# Altium project LightLink_V4.PrjPcb (part 2 of 2)

## Sheet STM32H753_PINOUT.SchDoc
size D; SheetNumber: 3; SheetTotal: 5
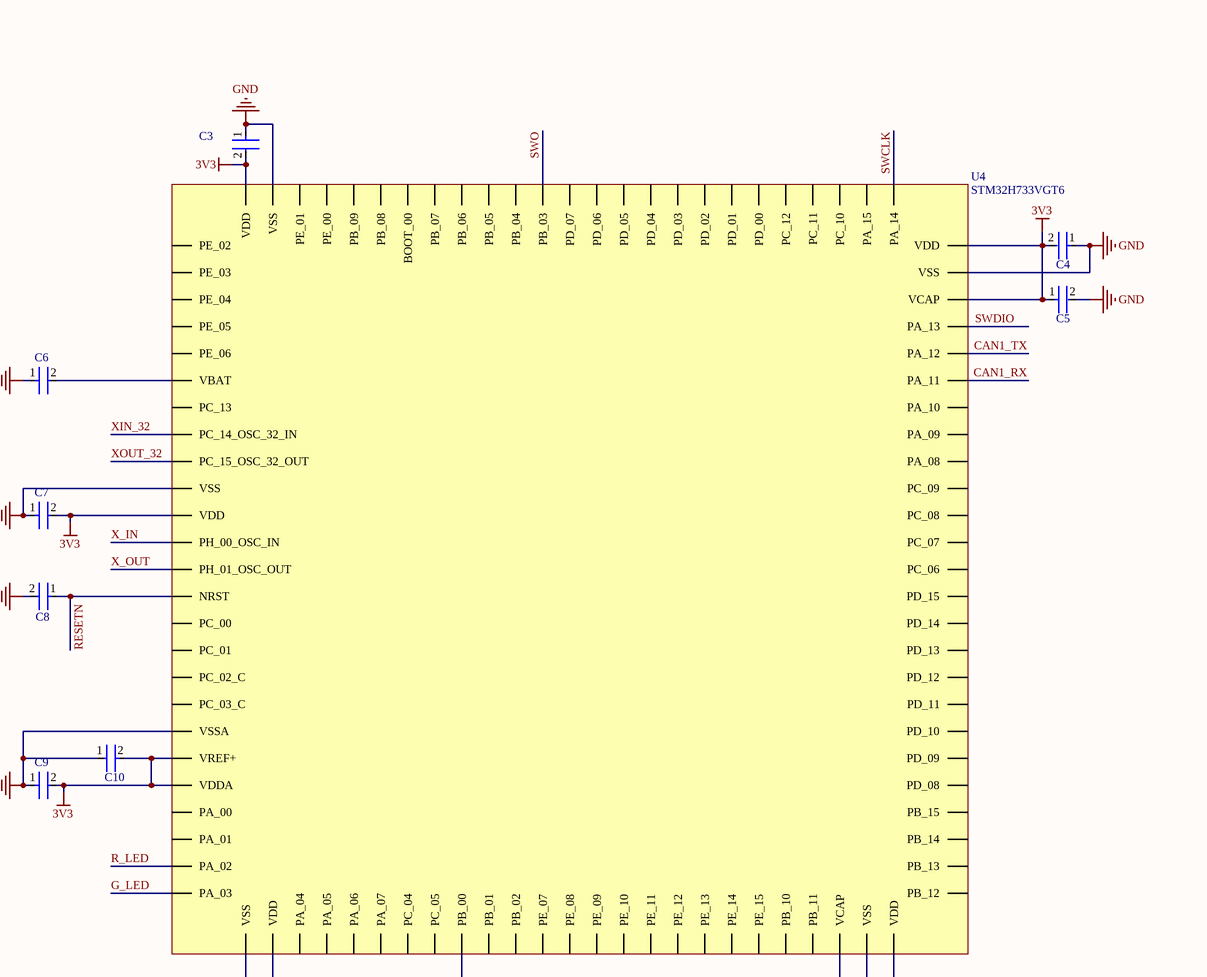
[diagram p5: STM32H753_PINOUT.SchDoc, top middle]
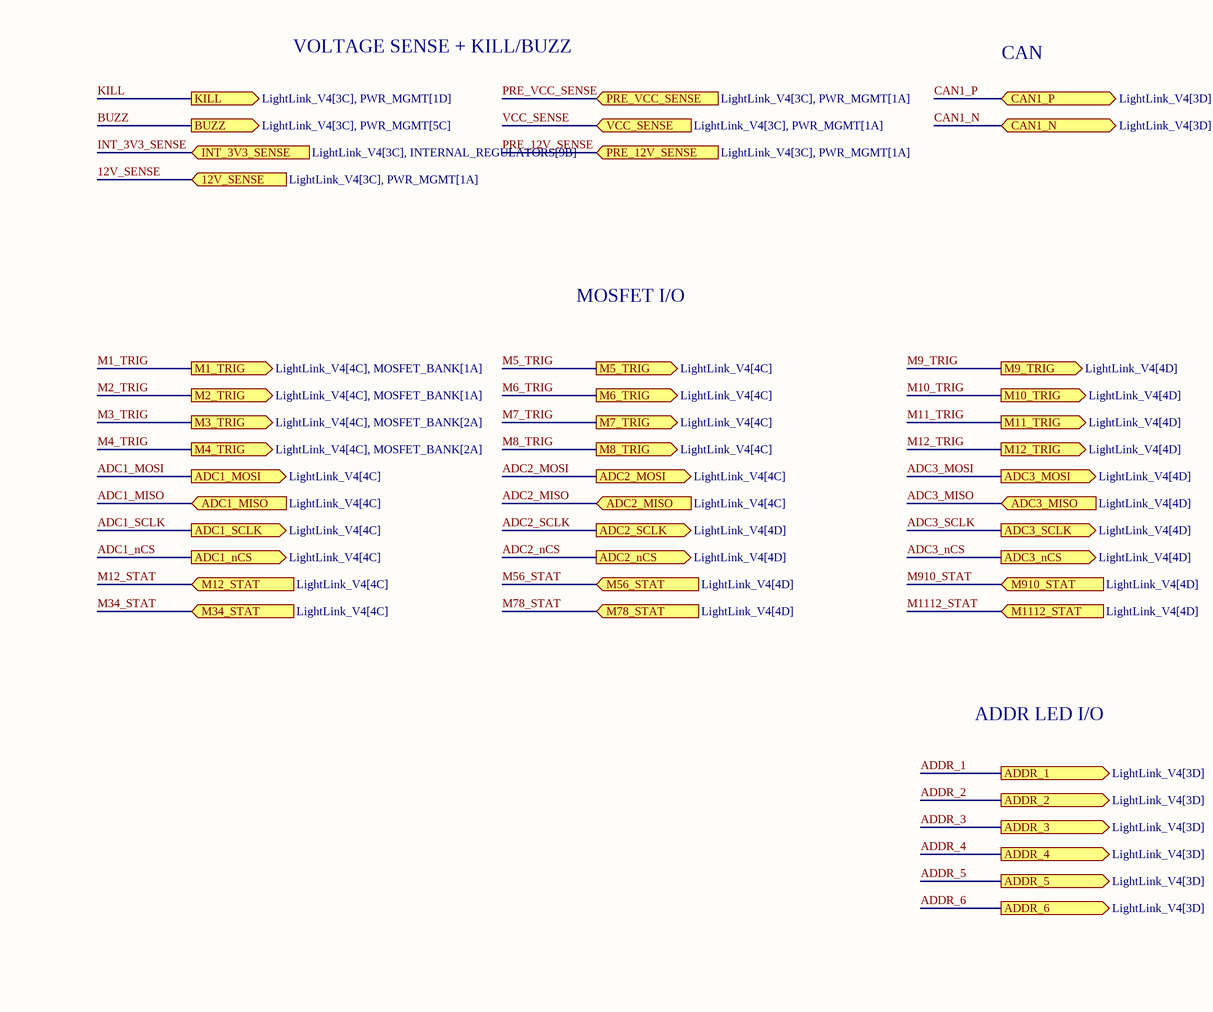
[diagram p6: STM32H753_PINOUT.SchDoc, top right]
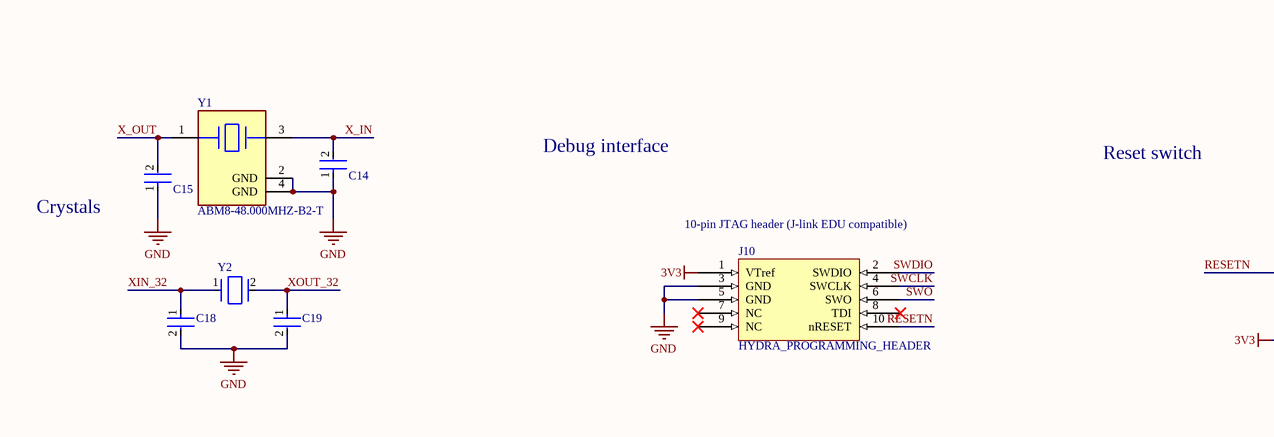
[diagram p7: STM32H753_PINOUT.SchDoc, bottom left]
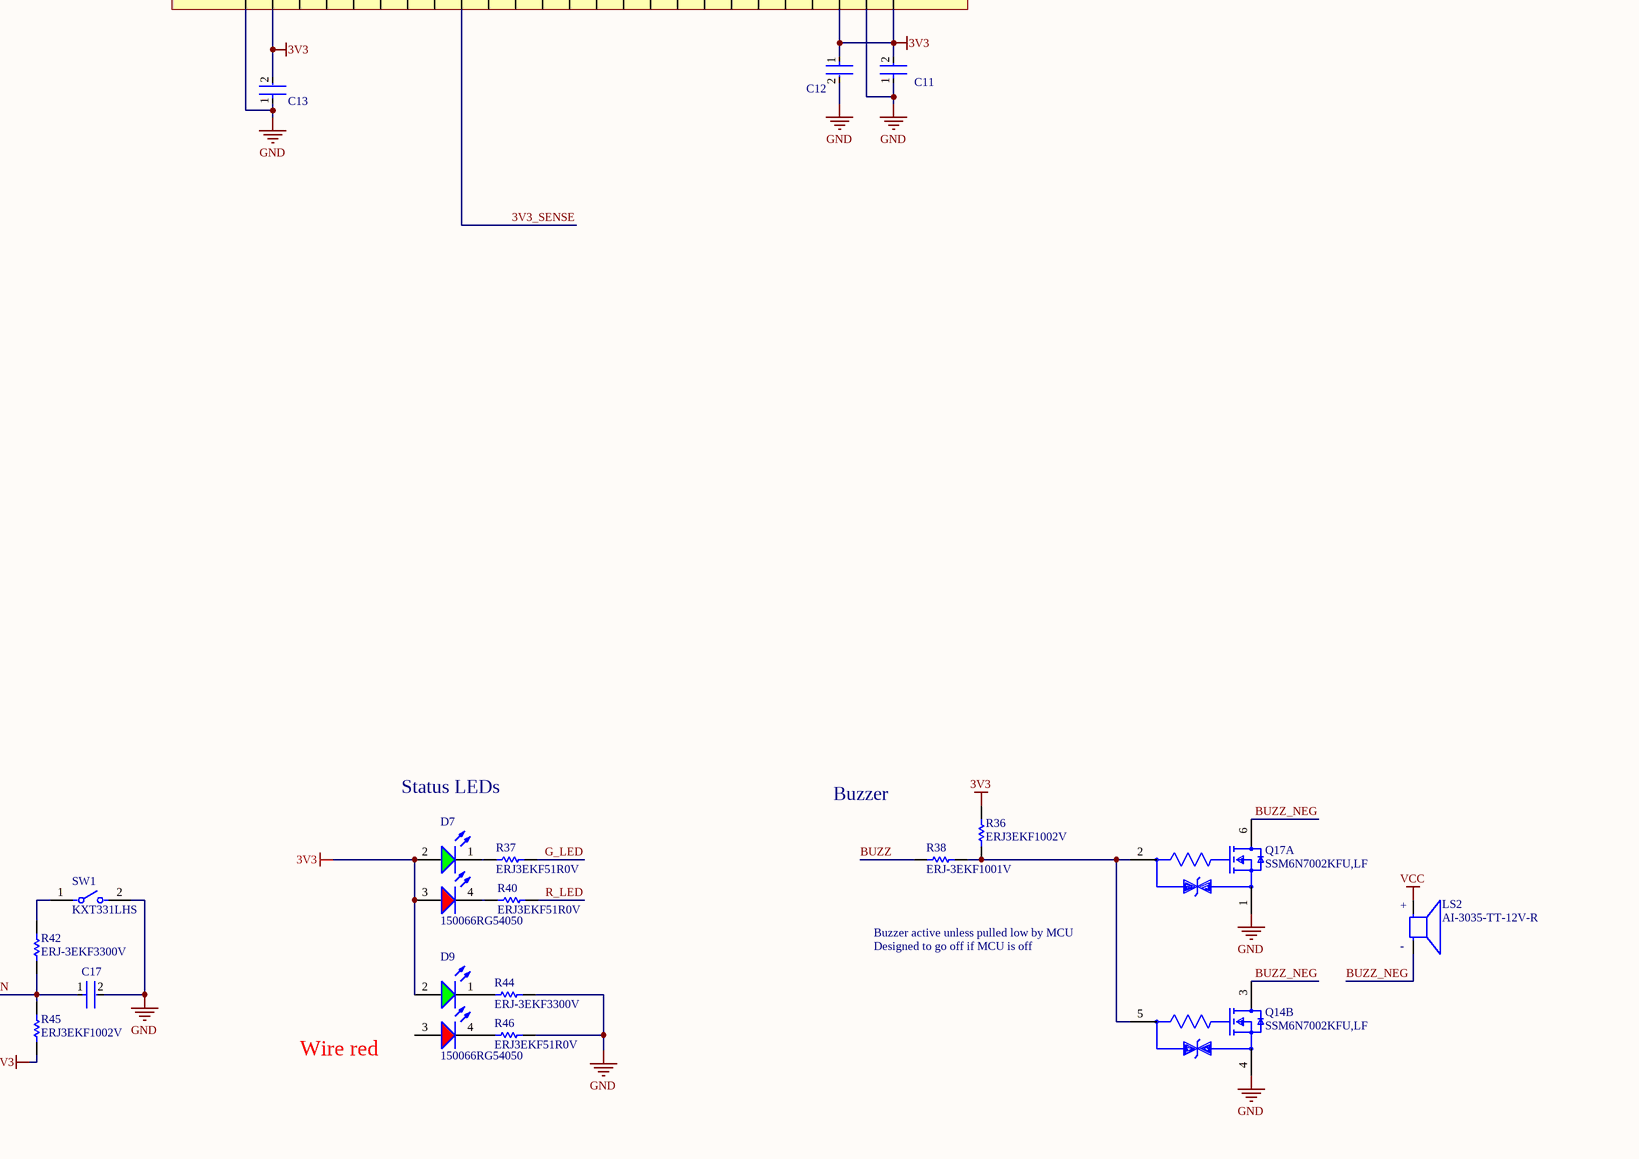
[diagram p8: STM32H753_PINOUT.SchDoc, bottom middle]
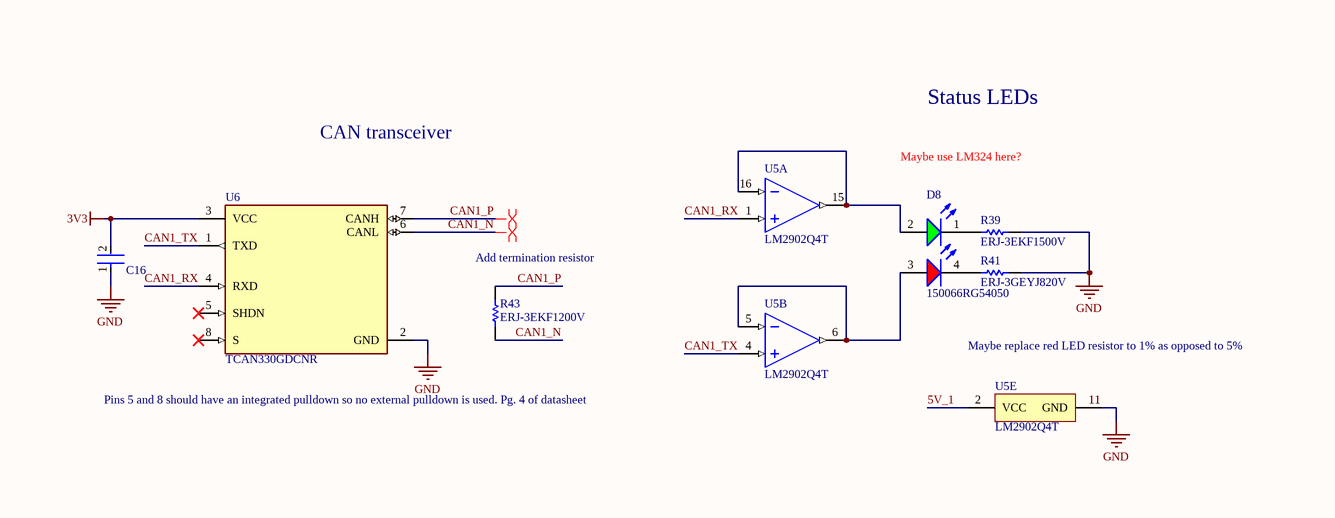
[diagram p9: STM32H753_PINOUT.SchDoc, bottom right]

### Parts
C3  C0402C104K8PACTU  [FP-C0402-BB-MFG]  (value not drawn)
C4  C0402C104K8PACTU  [FP-C0402-BB-MFG]  (value not drawn)
C5  C1005X7S1A225K050BC  [FP-C1005-050-0_15-0_1-MFG]  (value not drawn)
C6  C0402C104K8PACTU  [FP-C0402-BB-MFG]  (value not drawn)
C7  C0402C104K8PACTU  [FP-C0402-BB-MFG]  (value not drawn)
C8  C0402C104K8PACTU  [FP-C0402-BB-MFG]  (value not drawn)
C9  C0402C104K8PACTU  [FP-C0402-BB-MFG]  (value not drawn)
C10  GRM155R71C104KA88D  [FP-GRM15-MFG]  (value not drawn)
C11  C0402C104K8PACTU  [FP-C0402-BB-MFG]  (value not drawn)
C12  C1005X7S1A225K050BC  [FP-C1005-050-0_15-0_1-MFG]  (value not drawn)
C13  C0402C104K8PACTU  [FP-C0402-BB-MFG]  (value not drawn)
C14  08051A6R8CAT2A  [FP-0805-L_2_01_0_2-W_1_25-MFG]  (value not drawn)
C15  08051A6R8CAT2A  [FP-0805-L_2_01_0_2-W_1_25-MFG]  (value not drawn)
C16  C0402C104K8PACTU  [FP-C0402-BB-MFG]  (value not drawn)
C17  C0402C104K8PACTU  [FP-C0402-BB-MFG]  (value not drawn)
C18  C0805C180J5GACTU  [FP-C0805C-DN-MFG]  (value not drawn)
C19  C0805C180J5GACTU  [FP-C0805C-DN-MFG]  (value not drawn)
D7  150066RG54050  [WL-SBCD_0606]
D8  150066RG54050  [WL-SBCD_0606]
D9  150066RG54050  [WL-SBCD_0606]
J10  HYDRA_PROGRAMMING_HEADER  [3220-10-0300-00-Footprint-1]
LS2  AI-3035-TT-12V-R  [AI-3035-TT-12V-R-Footprint-1]
Q14  SSM6N7002KFU,LF  [FP-SSOP6-P-0_65A-MFG]  (part B of 2)
Q17  SSM6N7002KFU,LF  [FP-SSOP6-P-0_65A-MFG]  (part A of 2)
R36  ERJ3EKF1002V  [RESC1609X55X30LL15T15]
R37  ERJ3EKF51R0V  [RESC1608X55X30NL15T15]
R38  ERJ-3EKF1001V  [RESC1608X55X30LL15T15]
R39  ERJ-3EKF1500V  [RESC1608X55X30NL15T15]
R40  ERJ3EKF51R0V  [RESC1608X55X30NL15T15]
R41  ERJ-3GEYJ820V  [RESC1608X55X30NL15T15]
R42  ERJ-3EKF3300V  [RESC1608X55X30LL15T15]
R43  ERJ-3EKF1200V  [RESC1609X55X30ML15T15]
R44  ERJ-3EKF3300V  [RESC1608X55X30LL15T15]
R45  ERJ3EKF1002V  [RESC1609X55X30LL15T15]
R46  ERJ3EKF51R0V  [RESC1608X55X30NL15T15]
SW1  KXT331LHS  [FP-KXT331LHS-MFG]
U4  STM32H733VGT6  [STM32H733VGT6-Footprint-1]
U5  LM2902Q4T  [LM2902Q4T-Footprint-1]  (parts A,B,E of 5)
U6  TCAN330GDCNR  [FP-DCN0008A-MFG]
Y1  ABM8-48.000MHZ-B2-T  [FP-ABM8-MFG]
Y2  ECS-.327-12.5-1210-TR  [FP-ECX-1210-MFG]  (value not drawn)

### Ports
12V_SENSE (in, see LightLink_V4[3C], PWR_MGMT[1A]), ADC1_MISO (in, see LightLink_V4[4C]), ADC1_MOSI (out, see LightLink_V4[4C]), ADC1_nCS (out, see LightLink_V4[4C]), ADC1_SCLK (out, see LightLink_V4[4C]), ADC2_MISO (in, see LightLink_V4[4C]), ADC2_MOSI (out, see LightLink_V4[4C]), ADC2_nCS (out, see LightLink_V4[4D]), ADC2_SCLK (out, see LightLink_V4[4D]), ADC3_MISO (in, see LightLink_V4[4D]), ADC3_MOSI (out, see LightLink_V4[4D]), ADC3_nCS (out, see LightLink_V4[4D]), ADC3_SCLK (out, see LightLink_V4[4D]), ADDR_1 (out, see LightLink_V4[3D]), ADDR_2 (out, see LightLink_V4[3D]), ADDR_3 (out, see LightLink_V4[3D]), ADDR_4 (out, see LightLink_V4[3D]), ADDR_5 (out, see LightLink_V4[3D]), ADDR_6 (out, see LightLink_V4[3D]), BUZZ (out, see LightLink_V4[3C], PWR_MGMT[5C]), CAN1_N (bidir, see LightLink_V4[3D]), CAN1_P (bidir, see LightLink_V4[3D]), INT_3V3_SENSE (in, see LightLink_V4[3C], INTERNAL_REGULATORS[9B]), KILL (out, see LightLink_V4[3C], PWR_MGMT[1D]), M1_TRIG (out, see LightLink_V4[4C], MOSFET_BANK[1A]), M2_TRIG (out, see LightLink_V4[4C], MOSFET_BANK[1A]), M3_TRIG (out, see LightLink_V4[4C], MOSFET_BANK[2A]), M4_TRIG (out, see LightLink_V4[4C], MOSFET_BANK[2A]), M5_TRIG (out, see LightLink_V4[4C]), M6_TRIG (out, see LightLink_V4[4C]), M7_TRIG (out, see LightLink_V4[4C]), M8_TRIG (out, see LightLink_V4[4C]), M9_TRIG (out, see LightLink_V4[4D]), M10_TRIG (out, see LightLink_V4[4D]), M11_TRIG (out, see LightLink_V4[4D]), M12_STAT (in, see LightLink_V4[4C]), M12_TRIG (out, see LightLink_V4[4D]), M34_STAT (in, see LightLink_V4[4C]), M56_STAT (in, see LightLink_V4[4D]), M78_STAT (in, see LightLink_V4[4D]), M910_STAT (in, see LightLink_V4[4D]), M1112_STAT (in, see LightLink_V4[4D]), PRE_12V_SENSE (in, see LightLink_V4[3C], PWR_MGMT[1A]), PRE_VCC_SENSE (in, see LightLink_V4[3C], PWR_MGMT[1A]), VCC_SENSE (in, see LightLink_V4[3C], PWR_MGMT[1A])

### Nets
3V3: C3.2 C4.2 C5.1 C7.2 C9.2 C10.2 C11.2 C12.1 C13.2 C16.2 D7.2(A) D7.3(A) D9.2(A) J10.1(VTref) R36.2 R45.1 U4.11(VDD) U4.20(VREF+) U4.21(VDDA) U4.27(VDD) U4.48(VCAP) U4.50(VDD) U4.73(VCAP) U4.75(VDD) U4.100(VDD) U6.3(VCC)
GND: C3.1 C4.1 C5.2 C6.1 C7.1 C8.2 C9.1 C10.1 C11.1 C12.2 C13.1 C14.1 C15.1 C16.1 C17.2 C18.2 C19.2 J10.3(GND) J10.5(GND) Q14.4(Source2) Q17.1(Source1) R39.2 R41.2 R44.2 R46.2 SW1.2 U4.10(VSS) U4.19(VSSA) U4.26(VSS) U4.49(VSS) U4.74(VSS) U4.99(VSS) U5.11(GND) U6.2(GND) Y1.2(GND) Y1.4(GND)
VCC: LS2.P
3V3_SENSE: U4.34(PB_00)
5V_1: U5.2(VCC)
BUZZ: R38.1 ; port BUZZ
BUZZ_NEG: LS2.N Q14.3(Drain2) Q17.6(Drain1)
CAN1_N: R43.1 U6.6(CANL) ; port CAN1_N
CAN1_P: R43.2 U6.7(CANH) ; port CAN1_P
CAN1_RX: U4.70(PA_11) U5.1(1IN+) U6.4(RXD)
CAN1_TX: U4.71(PA_12) U5.4(2IN+) U6.1(TXD)
G_LED: R37.2 U4.25(PA_03)
R_LED: R40.2 U4.24(PA_02)
RESETN: C8.1 C17.1 J10.10(nRESET) R42.1 R45.2 U4.14(NRST)
SWCLK: J10.4(SWCLK) U4.76(PA_14)
SWDIO: J10.2(SWDIO) U4.72(PA_13)
SWO: J10.6(SWO) U4.89(PB_03)
X_IN: C14.2 U4.12(PH_00_OSC_IN) Y1.3
X_OUT: C15.2 U4.13(PH_01_OSC_OUT) Y1.1
XIN_32: C18.1 U4.8(PC_14_OSC_32_IN) Y2.1(In/Out)
XOUT_32: C19.1 U4.9(PC_15_OSC_32_OUT) Y2.2(Out/In)
NetC6_2: C6.2 U4.6(VBAT)
NetD7_1: D7.1(K) R37.1
NetD7_4: D7.4(K) R40.1
NetD8_1: D8.1(K) R39.1
NetD8_2: D8.2(A) U5.15(1OUT) U5.16(1IN-)
NetD8_3: D8.3(A) U5.5(2IN-) U5.6(2OUT)
NetD8_4: D8.4(K) R41.1
NetD9_1: D9.1(K) R44.1
NetD9_4: D9.4(K) R46.1
NetQ14_5: Q14.5(Gate2) Q17.2(Gate1) R36.1 R38.2
NetR42_2: R42.2 SW1.1

Not connected (* = marked no-connect by the designer): D9 3(A); J10 7(NC)* 8(TDI)* 9(NC)*; U4 1(PE_02) 2(PE_03) 3(PE_04) 4(PE_05) 5(PE_06) 7(PC_13) 15(PC_00) 16(PC_01) 17(PC_02_C) 18(PC_03_C) 22(PA_00) 23(PA_01) 28(PA_04) 29(PA_05) 30(PA_06) 31(PA_07) 32(PC_04) 33(PC_05) 35(PB_01) 36(PB_02) 37(PE_07) 38(PE_08) 39(PE_09) 40(PE_10) 41(PE_11) 42(PE_12) 43(PE_13) 44(PE_14) 45(PE_15) 46(PB_10) 47(PB_11) 51(PB_12) 52(PB_13) 53(PB_14) 54(PB_15) 55(PD_08) 56(PD_09) 57(PD_10) 58(PD_11) 59(PD_12) 60(PD_13) 61(PD_14) 62(PD_15) 63(PC_06) 64(PC_07) 65(PC_08) 66(PC_09) 67(PA_08) 68(PA_09) 69(PA_10) 77(PA_15) 78(PC_10) 79(PC_11) 80(PC_12) 81(PD_00) 82(PD_01) 83(PD_02) 84(PD_03) 85(PD_04) 86(PD_05) 87(PD_06) 88(PD_07) 90(PB_04) 91(PB_05) 92(PB_06) 93(PB_07) 94(BOOT_00) 95(PB_08) 96(PB_09) 97(PE_00) 98(PE_01); U6 5(SHDN)* 8(S)*

### Layout directives
differential pair: CAN1_N, CAN1_P

### Notes on the sheet
- VOLTAGE SENSE + KILL/BUZZ
- CAN
- MOSFET I/O
- ADDR LED I/O
- Status LEDs
- Buzzer
- CAN transceiver
- Maybe use LM324 here?
- Debug interface
- Reset switch
- (near C15) Crystals
- (near J10) 10-pin JTAG header (J-link EDU compatible)
- Buzzer active unless pulled low by MCU
- Designed to go off if MCU is off
- (near R43) Add termination resistor
- Maybe replace red LED resistor to 1% as opposed to 5%
- Wire red
- Pins 5 and 8 should have an integrated pulldown so no external pulldown is used. Pg. 4 of datasheet
- (in symbol CMP-00027-00003-1) +; -

### Library data of the parts
C3 C4 C6 C7 C9 C11 C13 = CMP-2008-02046-2: Manufacturer: Kemet; Material: Ceramic; Capacitance: 50 pF; Temperature Characteristic: X5R; Temperature Coefficient: 15%; Tolerance: 0.1; Voltage Rating: 10 V; Value: 50 pF; Package: C0402-BB; Temperature: -55°C to +125°C; ComponentLink2Description: Datasheet; Device Class L1: Passive Components; Height: 0.55mm; Lead Free: Yes; ComponentLink2URL: https://content.kemet.com/datasheets/KEM_C1002_X7R_SMD.pdf; Device Class L2: Capacitors; Temperature Range Low: -55°C; Temperature Range High: +125°C; RoHS: TRUE; Octopart: https://octopart.com/c0402c104k8pactu-kemet-140039; Automotive: No; Mouser Description: Capacitor 100 nF 10 VDC 0402; Category: Cap; Digikey Description: CAP CER 0.1UF 10V X5R 0402; Ipc Land Pattern Name: CAPC10050X50; Device Class L3: Ceramic Capacitors; Manufacturer Part Number: C0402C104K8PACTU
C5 C12 = CMP-08246-004344-1: CAP CER 2.2UF 10V X7S 0402; Dielectric Material: Ceramic; Tolerance: 10%; Mount: Surface Mount; Height: 0.5mm; Package Quantity: 1; Depth: 0.5mm; RoHS Compliant: Yes; Length: 1mm; Thickness: 0.022inch; Packaging: Tape and Reel; Capacitance: 2.2uF; Case Code (Imperial): 0402; Resistor Type: Ceramic; Dielectric: X7S; Case/Package: 0402; Min Operating Temperature: -55°C; Voltage Rating: 10V; Series: C; Weight: 2.3E-05oz; Width: 0.02inch; Voltage Rating (DC): 10V; Case Code (Metric): 1005; Max Operating Temperature: 125°C; Termination: SMD/SMT; Lead Free: Lead Free
C8 C16 C17 = CMP-2008-02046-2: CAP CER 0.1UF 10V X5R 0402; Manufacturer: Kemet; Material: Ceramic; Capacitance: 0.10 μF; Temperature Coefficient: 15%; Tolerance: 0.1; Value: 0.10 μF; Package: C0402-BB; Temperature: -55°C to +125°C; ComponentLink2Description: Datasheet; Temperature Characteristic: X5R; Device Class L1: Passive Components; Height: 0.55mm; Lead Free: Yes; ComponentLink2URL: https://content.kemet.com/datasheets/KEM_C1002_X7R_SMD.pdf; Device Class L2: Capacitors; Temperature Range Low: -55°C; Temperature Range High: +125°C; RoHS: TRUE; Octopart: https://octopart.com/c0402c104k8pactu-kemet-140039; Automotive: No; Mouser Description: Capacitor 100 nF 10 VDC 0402; Category: Cap; Voltage Rating: 10 V; Digikey Description: CAP CER 0.1UF 10V X5R 0402; Ipc Land Pattern Name: CAPC10050X50; Device Class L3: Ceramic Capacitors; Manufacturer Part Number: C0402C104K8PACTU
C10 = CMP-2100-03641-2: CAP CER 0.1UF 16V X7R 0402; Manufacturer: Murata; Standoff Height: 0mm; Tolerance: 10%; Voltage Rating: 16Vdc; Material: Ceramic; Capacitance: 0.10μF; Value: 0.10μF; RoHS: TRUE; Manufacturer Part Number: GRM155R71C104KA88D; Temperature Characteristic: X7R; Octopart: https://octopart.com/grm155r71c104ka88d-murata-196880; Digikey Description: CAP CER 0.1UF 16V X7R 0402; Device Class L3: Ceramic Capacitors; Height: 0.55mm; ComponentLink2Description: Datasheet; Temperature Range Low: -55°C; Ipc Land Pattern Name: CAPC10050X219; ComponentLink2URL: https://search.murata.co.jp/Ceramy/image/img/A01X/G101/ENG/GRM155R71H471KA01-01A.pdf; Device Class L1: Passive Components; Lead Free: yes; Category: Cap; Package: GRM15; Temperature: -55°C to +125°C; Device Class L2: Capacitors; Temperature Range High: +125°C; Mouser Description: 0402 0.1 uF 16V ±10 % Tolerance X7R SMT Multilayer Ceramic Capacitor
C14 C15 = CMP-1036-00709-3: General Purpose Ceramic Capacitor, 0805, 6.8pF, 0.25pF, C0G, 30ppm/°C, 100V; Dissipation Factor: 10%; Insulation Resistance: 100GR; Tolerance: 5%; Max Operating Temperature: 125°C; RoHS Compliant: Yes; Capacitance: 6.8pF; Termination: SMD/SMT; Number of Pins: 2; Packaging: Tape and Reel; Mount: Surface Mount; Case Code (Metric): 2012; Case Code (Imperial): 0805; Height: 0.71mm; Min Operating Temperature: -55°C; Width: 0.049inch; Temperature Coefficient: 0ppm/°C; Length: 2.01mm; Dielectric: C0G; Series: -; Voltage Rating (DC): 100V; Dielectric Material: Ceramic; Depth: 1.25mm; Contact Plating: Tin; Voltage Rating: 100V; Thickness: 0.037inch; Case/Package: 0805; Lead Free: Lead Free; Radiation Hardening: No; Voltage: 100V; Construction: Flat; Package Quantity: 1; REACH SVHC: No SVHC
C18 C19 = CMP-2007-00302-2: CAP CER 18PF 50V C0G/NP0 0805; Manufacturer: KEMET; Temperature Characteristic: C0G; Tolerance: 0.05; Material: Ceramic; Temperature Coefficient: 30ppm/°C; Device Class L2: Capacitors; Capacitance: 18 pF; Temperature: -55°C to +125°C; Value: 18 pF; Package: C0805C-DN; Mouser Description: Cap Ceramic 18pF 50V C0G 5% SMD 0805 125C Paper T/R; Height: 0.88mm; ComponentLink2URL: https://content.kemet.com/datasheets/KEM_C1003_C0G_SMD.pdf; RoHS: TRUE; Octopart: https://octopart.com/c0805c180j5gactu-kemet-144810; ComponentLink2Description: Datasheet; Temperature Range High: +125°C; Digikey Description: CAP CER 18PF 50V C0G/NP0 0805; Device Class L1: Passive Components; Category: Cap; Automotive: No; Device Class L3: Ceramic Capacitors; Voltage Rating: 50 V; Temperature Range Low: -55°C; Ipc Land Pattern Name: CAPC200125X78; Lead Free: Yes; Manufacturer Part Number: C0805C180J5GACTU
D7-D9 = CMP-004-00034-2: Led, Red/Grn, 180Mcd/230Mcd, 624Nm/525Nm Rohs Compliant: Yes
J10 = CMP-002-00075-1: CONN HEADER SMD 10POS 1.27MM (specifically compatible with J-Link EDU cable) PN: 3220-10-0300-00
LS2 = CMP-00027-00003-1: Audio Indicator 12V 12mA 110dBA 3.5KHz Resonant Frequency Thru-Hole
Q14 Q17 = CMP-35916-000009-1: MOSFET 2N-CH 60V 0.3A; Input Capacitance: 40pF; Continuous Drain Current (ID): 300mA; Max Power Dissipation: 285mW; FET Type: 2 N-Channel; Rds On Max: 1.5R; Mount: Surface Mount; Drain to Source Voltage (Vdss): 60V; Packaging: Tape and Reel
R36 R45 = CMP-1012-00623-3: Chip Resistor, 10 KOhm, +/- 1%, 0.1 W, -55 to 155 degC, 0603 (1608 Metric), RoHS, Tape and Reel; Manufacturer: Panasonic; Voltage Rating: 75V; Case\/Package: 0603; Power Rating: 100mW; Resistance: 10KOhm; Temperature Coefficient: 100ppm\/degreesC; Number of Pins: 2; Package Reference: 603; Depth: 0.8mm; Mount: SurfaceMount; Package Description: 2-Pin Surface Mount Device, Body 1.6 x 0.85 mm; Datasheet Version: 02/2017; Length: 1.6mm; Lead Free: LeadFree; Height: 0.45mm; Number of Terminations: 2; Max Power Dissipation: 100mW; Min Operating Temperature: -55degC; Datasheet URL: https://industrial.panasonic.com/cdbs/www-data/pdf/RDA0000/AOA0000C304.pdf; Termination: SMD/SMT; Case Code (Metric): 1608; Case Code (Imperial): 0603; Tolerance: 1%; Max Operating Temperature: 155degC; RoHSCompliant: true; Voltage Rating (DC): 75V; Radiation Hardening: No; Packaging: TapeandReel; Composition: ThickFilm; Mounting Technology: SurfaceMount; Manufacturer URL: http://www.panasonic.com/; Width: 0.031inch; REACH SVHC: NoSVHC; Contact Plating: Tin; Military Standard: Not; Package Quantity: 1
R37 R40 R46 = CMP-2000-00547-1: Manufacturer: Panasonic; Part Number: ERJ3EKF51R0V
R38 = CMP-2000-00180-1: Manufacturer: Panasonic; Part Number: ERJ-3EKF1001V
R39 = CMP-2000-00256-1: Manufacturer: Panasonic; Part Number: ERJ-3EKF1500V
R41 = CMP-1012-00048-2: Manufacturer: Panasonic; Part Number: ERJ-3GEYJ820V
R42 R44 = CMP-2000-00435-2: Chip Resistor, 330 Ohm, +/- 1%, 0.1 W, -55 to 155 degC, 0603 (1608 Metric), RoHS, Tape and Reel; Gender: Male; Mating Cycles: 10000; Current Rating: 500 mA; Voltage Rating: 10 V; REACH SVHC: No SVHC; PackageDescription: 2-Pin Surface Mount Device, Body 1.6 x 0.85 mm; Contact Finish: Gold; Pins: 8; ComponentLink1Description: Manufacturer URL; Packaging: Tape and Reel; Max Operating Temperature: 85 degC; Contact Material: Copper; Height: 1.45 mm; Width: 1.45 mm; DatasheetVersion: Apr-15; Package Quantity: 1500; Contact Plating: Gold; PackageReference: 0603; Mount: Surface Mount; Lead Pitch: 1.1 mm; Min Operating Temperature: -25 degC; ComponentLink1URL: http://www.panasonic.com/; ComponentLink2URL: http://industrial.panasonic.com/cdbs/www-data/pdf/RDA0000/AOA0000C86.pdf; Length: 13.7 mm; ComponentLink2Description: Datasheet; RoHSCompliant: true
R43 = CMP-2000-00213-2: Chip Resistor, 120 Ohm, +/- 1%, 0.1 W, -55 to 155 degC, 0603 (1608 Metric), RoHS, Tape and Reel; Manufacturer: Panasonic; Power Rating: 100mW; Voltage Rating (DC): 75V; Resistance: 120Ohm; Temperature Coefficient: 100ppm/degreesC; Number of Terminations: 2; Military Standard: Not; Tolerance: 1%; Min Operating Temperature: -55degC; Packaging: TapeandReel; Lead Free: LeadFree; Max Operating Temperature: 155degC; Manufacturer URL: http://www.panasonic.com/; Case Code (Imperial): 0603; REACH SVHC: NoSVHC; Width: 0.031inch; Datasheet URL: https://industrial.panasonic.com/cdbs/www-data/pdf/RDA0000/AOA0000C283.pdf; RoHSCompliant: true; Max Power Dissipation: 100mW; Termination: SMD/SMT; Package Reference: 0603; Height: 0.022inch; Depth: 0.8mm; Package Description: 2-Pin Surface Mount Device, Body 1.6 x 0.85 mm; Contact Plating: Tin; Length: 1.6mm; Package URL: http://www.st.com/st-web-ui/static/active/en/resource/technical/document/datasheet/CD00001320.pdf; Radiation Hardening: No; Package Quantity: 1; Number of Pins: 2; Datasheet Version: 42095.0; Voltage Rating: 75V; Composition: ThickFilm; Case/Package: 0603; Mount: SurfaceMount; Case Code (Metric): 1608
SW1 = CMP-10040-000029-1: SWITCH TACTILE SPST-NO 0.02A 15V; Operating Force: 240gf; Switch Travel: 0.13mm; Illumination Type: Non-Illuminated; Throw Configuration: SPST; Number of Ports: 1; Current Rating: 5A; Mechanical Life: 500000Cycles; Switch Function: Off-Mom; Connector Type: USB; Actuator Type: Standard; Gender: Receptacle; Number of Contacts: 24; Contact Plating: Gold; Insulation Color: Black; Min Operating Temperature: -40°C; Packaging: Tape and Reel; Flammability Rating: UL94 V-0; Max Operating Temperature: 85°C; Termination: Solder; Mount: Surface Mount
U4 = CMP-020-00024-1: MCU 32-bit ARM Cortex M7 RISC 1MB Flash 1.8V/2.5V/3.3V 100-Pin LQFP Tray
U5 = CMP-014-00004-1: LM2902 Series 30 V 1.3 MHz Low-Power Quad Operational Amplifier - QFN-16 (3x3)
U6 = CMP-04872-000178-1: IC TRANSCEIVER 1/1 SOT23-8; Data Rate: 1Mbps; Packaging: Tape and Reel; Min Operating Temperature: -40°C; Max Operating Temperature: 125°C; RoHS Compliant: Yes; Lead Free: Lead Free; Case/Package: SOT-23-8; Mount: Surface Mount
Y1 = CMP-27762-011708-1: Crystal 48MHz ±20ppm 18pF SMD-4 3.2mm x 2.5mm; Series Resistance: 35R; Frequency Stability: 50ppm; Package Quantity: 1000; Packaging: Tape and Reel; Mount: Surface Mount; Length: 3.2mm; Load Capacitance: 18pF; Max Operating Temperature: 70°C; Operating Frequency: 48 MHz; RoHS Compliant: Yes; Series: ABM8; Frequency Tolerance: 20ppm; Lead Free: Lead Free; Min Operating Temperature: -20°C; Case/Package: CSMD; Number of Pins: 4; Height: 0.031inch; ESR (Equivalent Series Resistance): 35R; Frequency: 48MHz; Radiation Hardening: No; Width: 0.098inch; Tolerance: 20ppm; Termination: SMD/SMT; Depth: 2.5mm; Resistor Type: Ceramic; REACH SVHC: No SVHC
Y2 = CMP-40224-000006-1: CRYSTAL 32.7680KHZ 12.5PF SMD; Manufacturer: ECS International; Frequency: 32.768kHz; Esr: 90kΩ; Tolerance: 20ppm; Device Class L1: Passive Components; Load Capacitance: 12.5pF; Temperature: -40°C to +85°C; ComponentLink2URL: https://ecsxtal.com/store/pdf/ECX-1210.pdf; Series: ECX-1210; Octopart: https://octopart.com/ecs-.327-12.5-1210-tr-ecs+international-81221340; ComponentLink2Description: Datasheet; Temperature Range Low: -40°C; Digikey Description: CRYSTAL 32.7680KHZ 12.5PF SMD; Lead Free: Yes; RoHS: TRUE; Device Class L3: Crystals; Automotive: No; Category: Crys; Height: 0.5mm; Manufacturer Part Number: ECS-.327-12.5-1210-TR; Temperature Range High: +85°C; Device Class L2: Crystals / Oscillators; Package: ECX-1210

## Sheet MOSFET_BANK.SchDoc
size C; SheetNumber: 4; SheetTotal: 5
Used 3 times, as channels MOSFET_BANK, MOSFET_BANK, MOSFET_BANK. Parts and nets are listed once, with the designators drawn on the sheet.
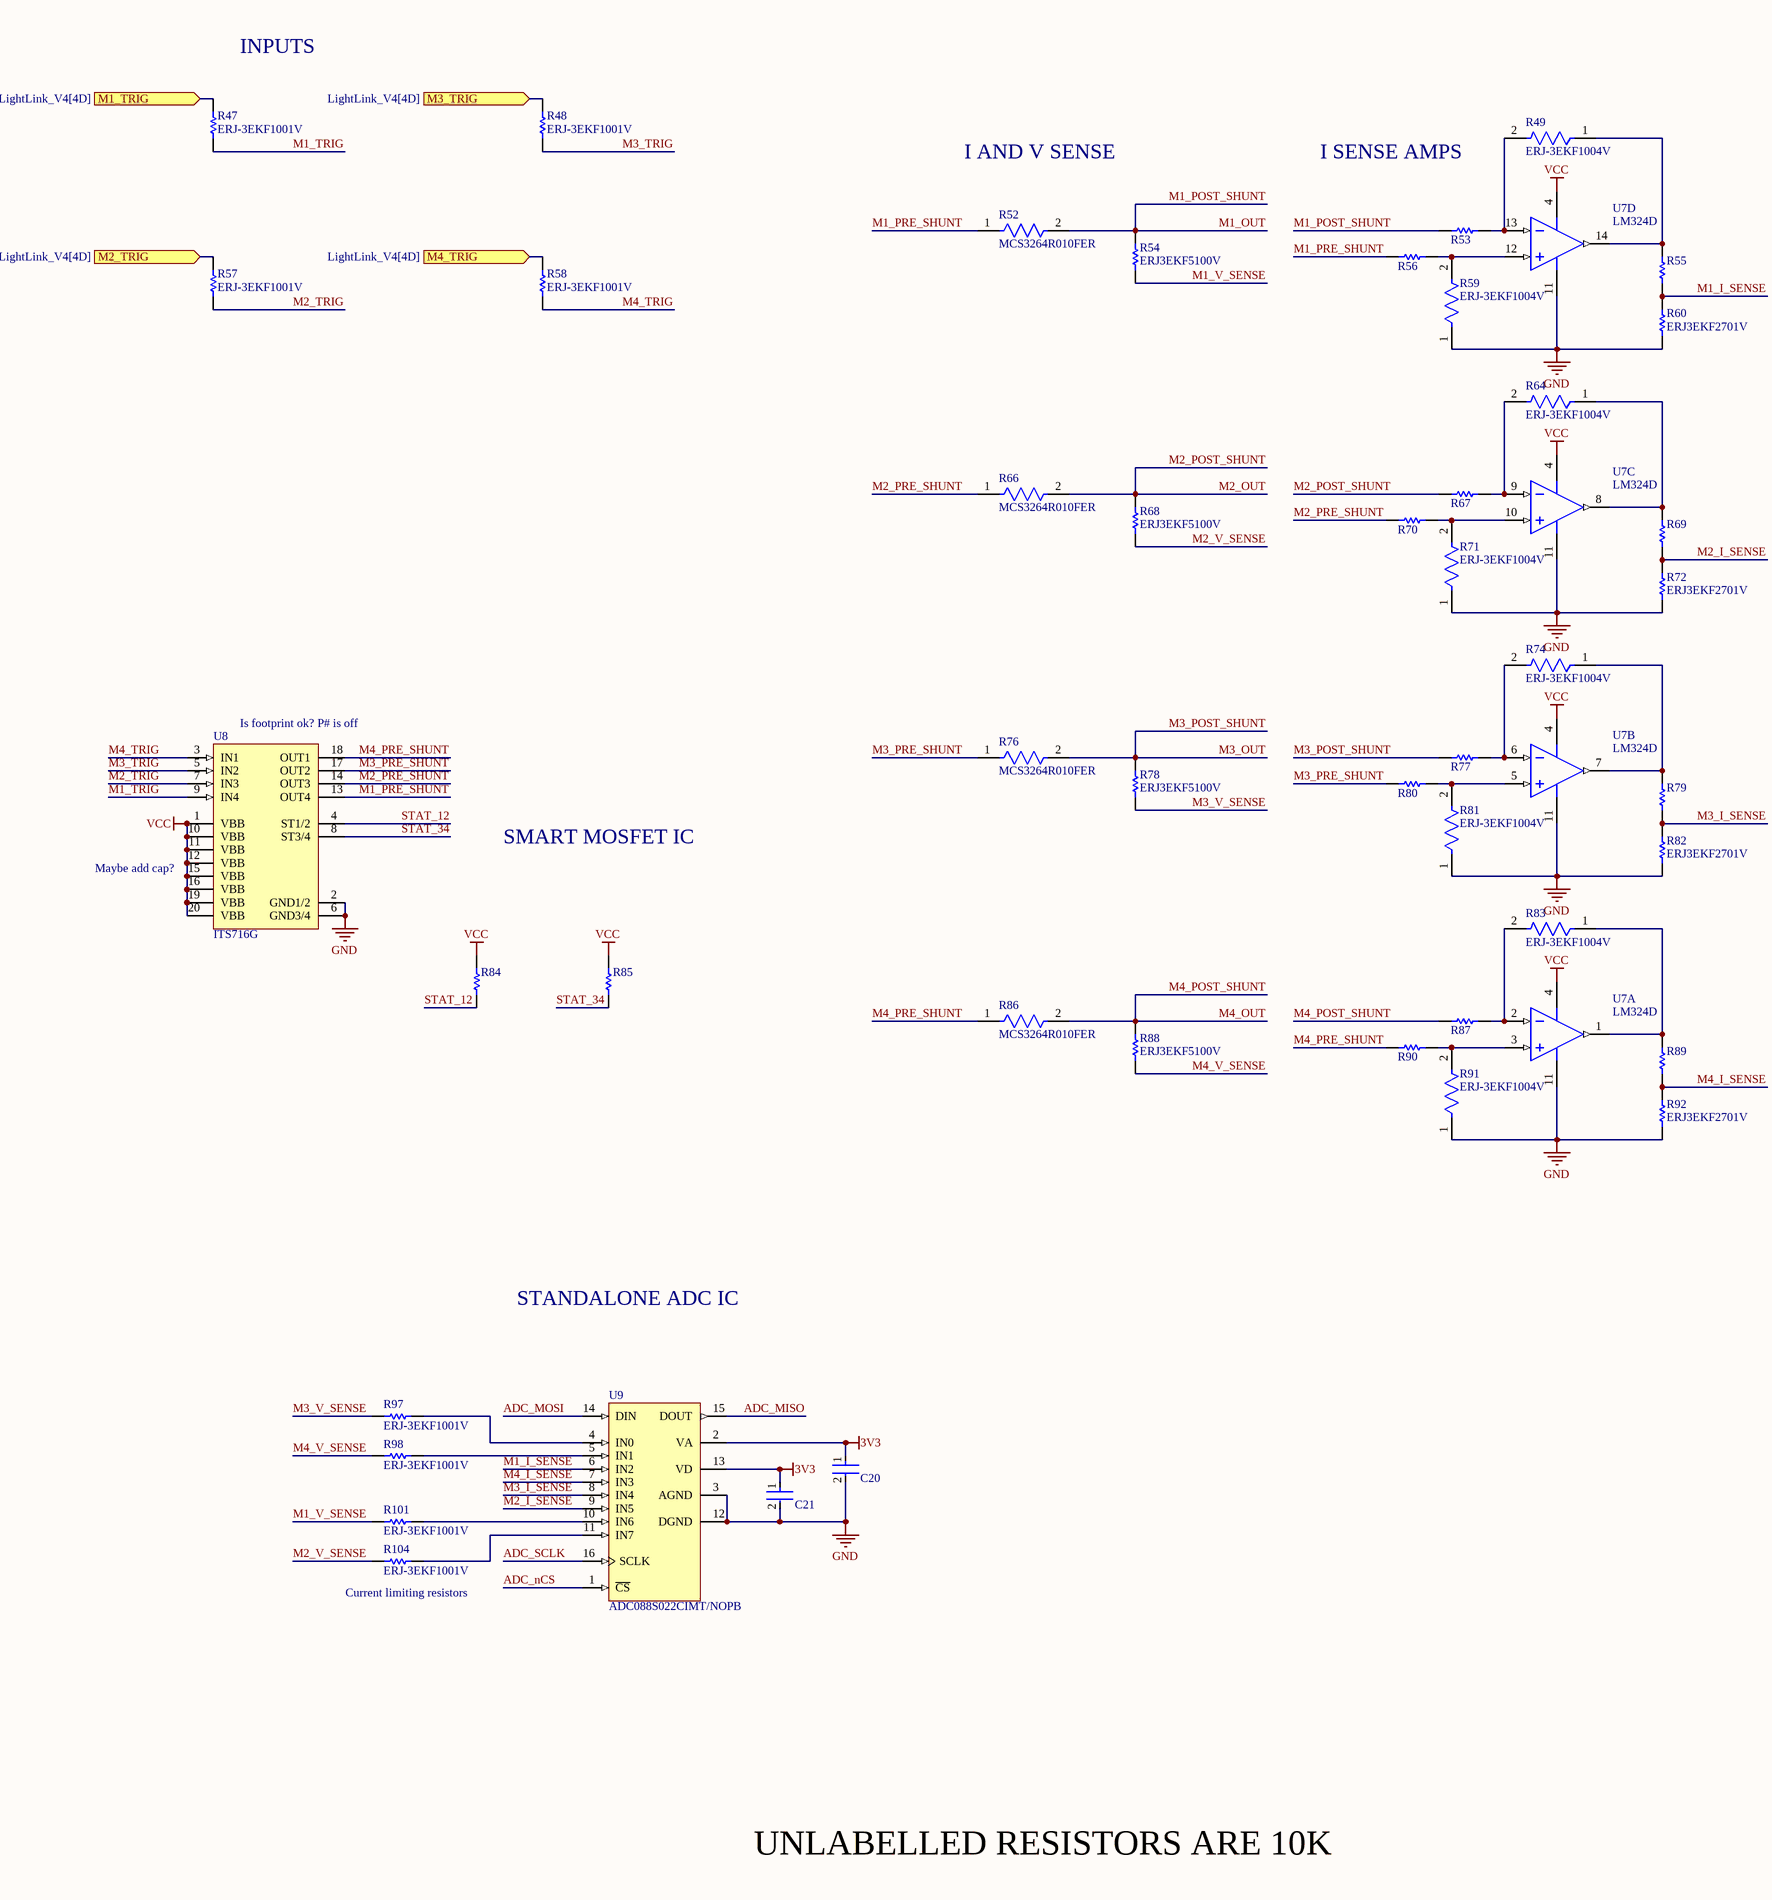
[diagram p10: MOSFET_BANK.SchDoc, left]
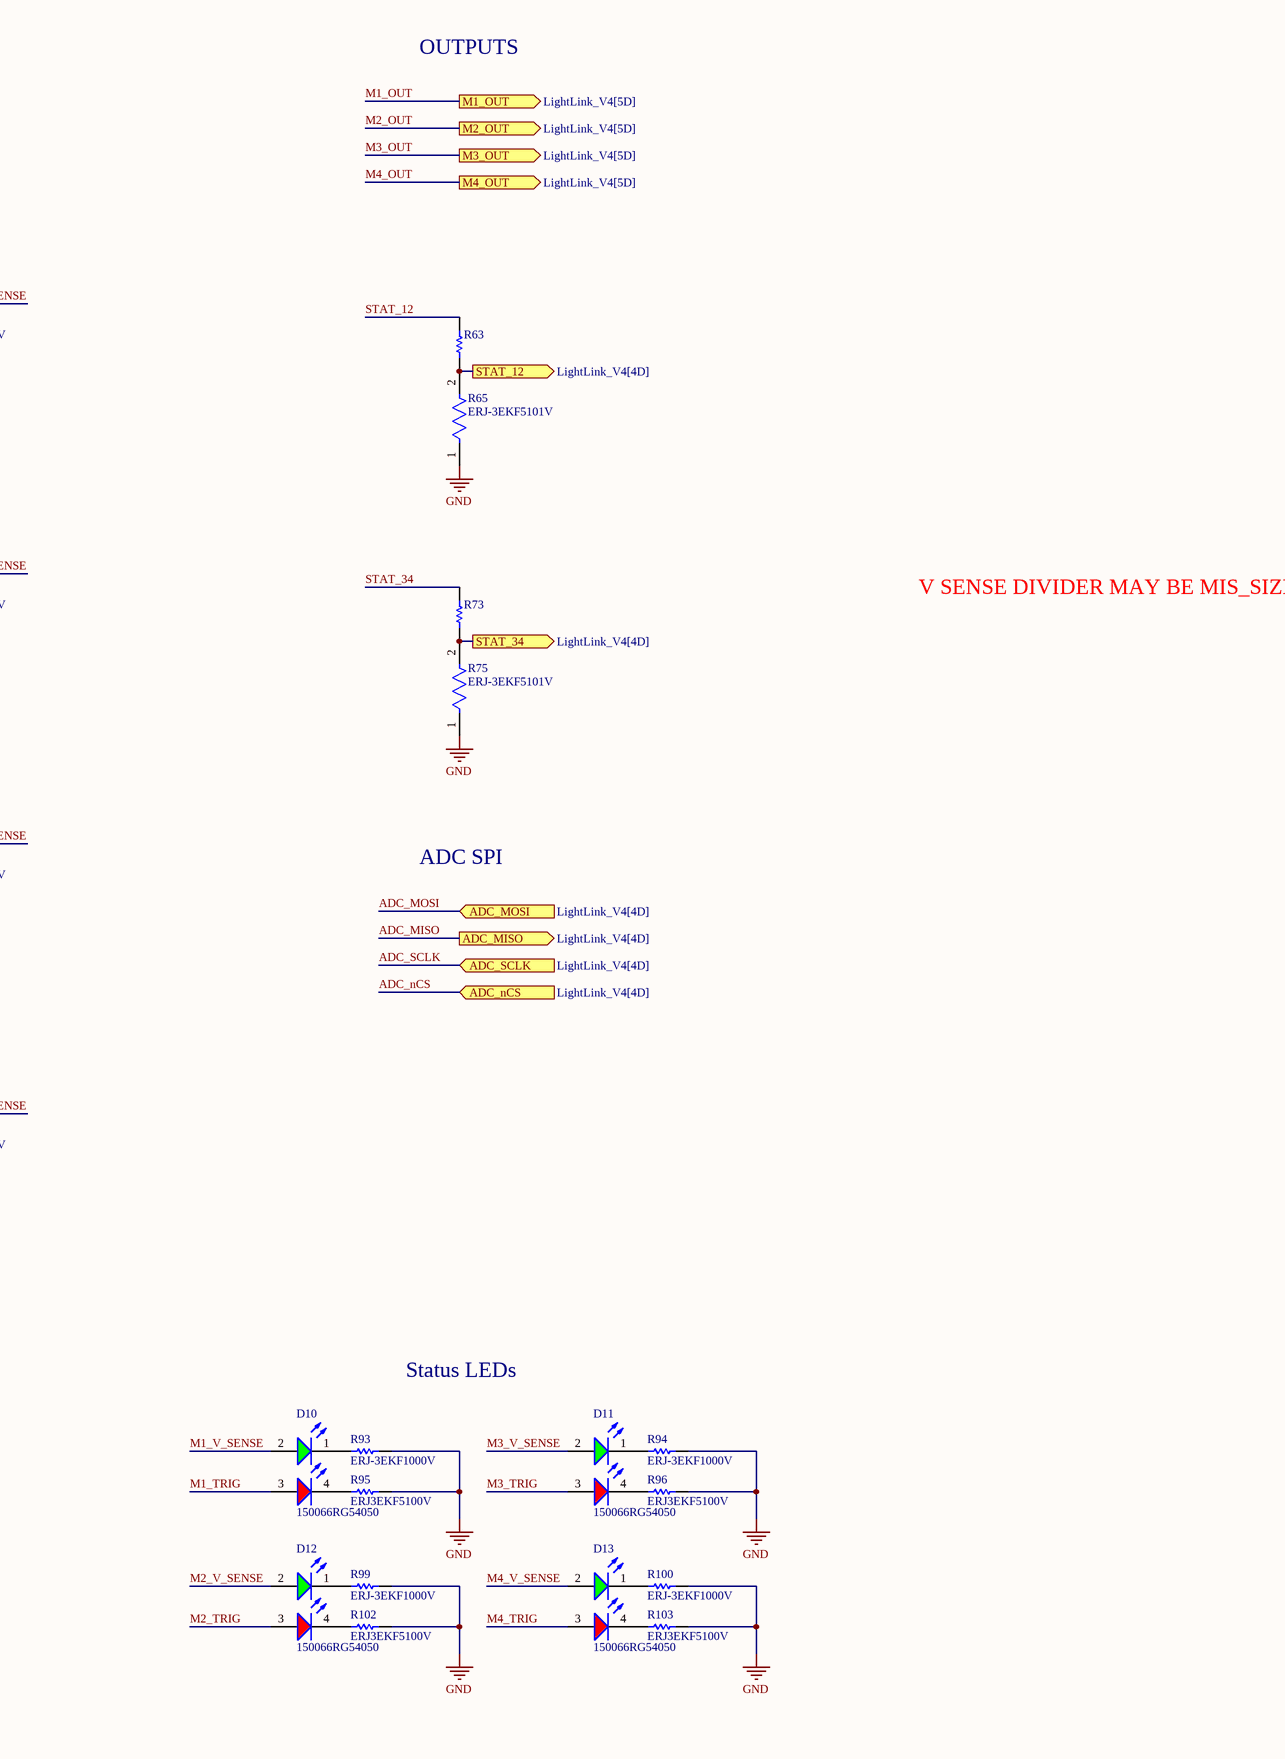
[diagram p11: MOSFET_BANK.SchDoc, right]

### Parts
C20  C0402C104K8PACTU  [FP-C0402-BB-MFG]  (value not drawn)
C21  C0402C104K8PACTU  [FP-C0402-BB-MFG]  (value not drawn)
D10  150066RG54050  [WL-SBCD_0606]
D11  150066RG54050  [WL-SBCD_0606]
D12  150066RG54050  [WL-SBCD_0606]
D13  150066RG54050  [WL-SBCD_0606]
R47  ERJ-3EKF1001V  [RESC1608X55X30LL15T15]
R48  ERJ-3EKF1001V  [RESC1608X55X30LL15T15]
R49  ERJ-3EKF1004V  [FP-ERJ3EK-IPC_C]
R52  MCS3264R010FER  [FP-MCS3264-MFG]
R53  ERJ3EKF1002V  [RESC1609X55X30LL15T15]  (value not drawn)
R54  ERJ3EKF5100V  [RESC1608X55X30NL15T15]
R55  ERJ3EKF1002V  [RESC1609X55X30LL15T15]  (value not drawn)
R56  ERJ3EKF1002V  [RESC1609X55X30LL15T15]  (value not drawn)
R57  ERJ-3EKF1001V  [RESC1608X55X30LL15T15]
R58  ERJ-3EKF1001V  [RESC1608X55X30LL15T15]
R59  ERJ-3EKF1004V  [FP-ERJ3EK-IPC_C]
R60  ERJ3EKF2701V  [RESC1608X55X30LL15T15]
R63  ERJ3EKF1002V  [RESC1609X55X30LL15T15]  (value not drawn)
R64  ERJ-3EKF1004V  [FP-ERJ3EK-IPC_C]
R65  ERJ-3EKF5101V  [FP-ERJ3EK-MFG]
R66  MCS3264R010FER  [FP-MCS3264-MFG]
R67  ERJ3EKF1002V  [RESC1609X55X30LL15T15]  (value not drawn)
R68  ERJ3EKF5100V  [RESC1608X55X30NL15T15]
R69  ERJ3EKF1002V  [RESC1609X55X30LL15T15]  (value not drawn)
R70  ERJ3EKF1002V  [RESC1609X55X30LL15T15]  (value not drawn)
R71  ERJ-3EKF1004V  [FP-ERJ3EK-IPC_C]
R72  ERJ3EKF2701V  [RESC1608X55X30LL15T15]
R73  ERJ3EKF1002V  [RESC1609X55X30LL15T15]  (value not drawn)
R74  ERJ-3EKF1004V  [FP-ERJ3EK-IPC_C]
R75  ERJ-3EKF5101V  [FP-ERJ3EK-MFG]
R76  MCS3264R010FER  [FP-MCS3264-MFG]
R77  ERJ3EKF1002V  [RESC1609X55X30LL15T15]  (value not drawn)
R78  ERJ3EKF5100V  [RESC1608X55X30NL15T15]
R79  ERJ3EKF1002V  [RESC1609X55X30LL15T15]  (value not drawn)
R80  ERJ3EKF1002V  [RESC1609X55X30LL15T15]  (value not drawn)
R81  ERJ-3EKF1004V  [FP-ERJ3EK-IPC_C]
R82  ERJ3EKF2701V  [RESC1608X55X30LL15T15]
R83  ERJ-3EKF1004V  [FP-ERJ3EK-IPC_C]
R84  ERJ3EKF1002V  [RESC1609X55X30LL15T15]  (value not drawn)
R85  ERJ3EKF1002V  [RESC1609X55X30LL15T15]  (value not drawn)
R86  MCS3264R010FER  [FP-MCS3264-MFG]
R87  ERJ3EKF1002V  [RESC1609X55X30LL15T15]  (value not drawn)
R88  ERJ3EKF5100V  [RESC1608X55X30NL15T15]
R89  ERJ3EKF1002V  [RESC1609X55X30LL15T15]  (value not drawn)
R90  ERJ3EKF1002V  [RESC1609X55X30LL15T15]  (value not drawn)
R91  ERJ-3EKF1004V  [FP-ERJ3EK-IPC_C]
R92  ERJ3EKF2701V  [RESC1608X55X30LL15T15]
R93  ERJ-3EKF1000V  [RESC1608X55X30LL15T15]
R94  ERJ-3EKF1000V  [RESC1608X55X30LL15T15]
R95  ERJ3EKF5100V  [RESC1608X55X30NL15T15]
R96  ERJ3EKF5100V  [RESC1608X55X30NL15T15]
R97  ERJ-3EKF1001V  [RESC1608X55X30LL15T15]
R98  ERJ-3EKF1001V  [RESC1608X55X30LL15T15]
R99  ERJ-3EKF1000V  [RESC1608X55X30LL15T15]
R100  ERJ-3EKF1000V  [RESC1608X55X30LL15T15]
R101  ERJ-3EKF1001V  [RESC1608X55X30LL15T15]
R102  ERJ3EKF5100V  [RESC1608X55X30NL15T15]
R103  ERJ3EKF5100V  [RESC1608X55X30NL15T15]
R104  ERJ-3EKF1001V  [RESC1608X55X30LL15T15]
U7  LM324D  [D0014A_L]  (parts A,B,C,D of 4)
U8  ITS716G  [INF-PG-DSO-20-32_L]
U9  ADC088S022CIMT/NOPB  [MTC16_L]

### Ports
ADC_MISO (out, see LightLink_V4[4D]), ADC_MOSI (in, see LightLink_V4[4D]), ADC_nCS (in, see LightLink_V4[4D]), ADC_SCLK (in, see LightLink_V4[4D]), M1_OUT (out, see LightLink_V4[5D]), M1_TRIG (in, see LightLink_V4[4D]), M2_OUT (out, see LightLink_V4[5D]), M2_TRIG (in, see LightLink_V4[4D]), M3_OUT (out, see LightLink_V4[5D]), M3_TRIG (in, see LightLink_V4[4D]), M4_OUT (out, see LightLink_V4[5D]), M4_TRIG (in, see LightLink_V4[4D]), STAT_12 (out, see LightLink_V4[4D]), STAT_34 (out, see LightLink_V4[4D])

### Nets
3V3: C20.1 C21.1 U9.2(VA) U9.13(VD)
GND: C20.2 C21.2 R59.1 R60.1 R65.1 R71.1 R72.1 R75.1 R81.1 R82.1 R91.1 R92.1 R93.2 R94.2 R95.2 R96.2 R99.2 R100.2 R102.2 R103.2 U7.11(GND) U8.2(GND1/2) U8.6(GND3/4) U9.3(AGND) U9.12(DGND)
VCC: R84.2 R85.2 U7.4(VCC) U8.1(VBB) U8.10(VBB) U8.11(VBB) U8.12(VBB) U8.15(VBB) U8.16(VBB) U8.19(VBB) U8.20(VBB)
ADC_MISO: U9.15(DOUT) ; port ADC_MISO
ADC_MOSI: U9.14(DIN) ; port ADC_MOSI
ADC_nCS: U9.1(~{CS}) ; port ADC_nCS
ADC_SCLK: U9.16(SCLK) ; port ADC_SCLK
M1_I_SENSE: R55.1 R60.2 U9.6(IN2)
M1_OUT: R52.2 R53.2 R54.2 ; port M1_OUT  [also labelled M1_POST_SHUNT]
M1_PRE_SHUNT: R52.1 R56.2 U8.13(OUT4)
M1_TRIG: D10.3(A) R47.1 U8.9(IN4)
M1_TRIG: R47.2 ; port M1_TRIG  [a separate net that carries the same name]
M1_V_SENSE: D10.2(A) R54.1 R101.1
M2_I_SENSE: R69.1 R72.2 U9.9(IN5)
M2_OUT: R66.2 R67.2 R68.2 ; port M2_OUT  [also labelled M2_POST_SHUNT]
M2_PRE_SHUNT: R66.1 R70.2 U8.14(OUT3)
M2_TRIG: D12.3(A) R57.1 U8.7(IN3)
M2_TRIG: R57.2 ; port M2_TRIG  [a separate net that carries the same name]
M2_V_SENSE: D12.2(A) R68.1 R104.1
M3_I_SENSE: R79.1 R82.2 U9.8(IN4)
M3_OUT: R76.2 R77.2 R78.2 ; port M3_OUT  [also labelled M3_POST_SHUNT]
M3_PRE_SHUNT: R76.1 R80.2 U8.17(OUT2)
M3_TRIG: D11.3(A) R48.1 U8.5(IN2)
M3_TRIG: R48.2 ; port M3_TRIG  [a separate net that carries the same name]
M3_V_SENSE: D11.2(A) R78.1 R97.1
M4_I_SENSE: R89.1 R92.2 U9.7(IN3)
M4_OUT: R86.2 R87.2 R88.2 ; port M4_OUT  [also labelled M4_POST_SHUNT]
M4_PRE_SHUNT: R86.1 R90.2 U8.18(OUT1)
M4_TRIG: D13.3(A) R58.1 U8.3(IN1)
M4_TRIG: R58.2 ; port M4_TRIG  [a separate net that carries the same name]
M4_V_SENSE: D13.2(A) R88.1 R98.1
STAT_12: R63.2 R84.1 U8.4(ST1/2)
STAT_12: R63.1 R65.2 ; port STAT_12  [a separate net that carries the same name]
STAT_34: R73.2 R85.1 U8.8(ST3/4)
STAT_34: R73.1 R75.2 ; port STAT_34  [a separate net that carries the same name]
NetD10_1: D10.1(K) R93.1
NetD10_4: D10.4(K) R95.1
NetD11_1: D11.1(K) R94.1
NetD11_4: D11.4(K) R96.1
NetD12_1: D12.1(K) R99.1
NetD12_4: D12.4(K) R102.1
NetD13_1: D13.1(K) R100.1
NetD13_4: D13.4(K) R103.1
NetR49_1: R49.1 R55.2 U7.14(4OUT)
NetR49_2: R49.2 R53.1 U7.13(4IN-)
NetR56_1: R56.1 R59.2 U7.12(4IN+)
NetR64_1: R64.1 R69.2 U7.8(3OUT)
NetR64_2: R64.2 R67.1 U7.9(3IN-)
NetR70_1: R70.1 R71.2 U7.10(3IN+)
NetR74_1: R74.1 R79.2 U7.7(2OUT)
NetR74_2: R74.2 R77.1 U7.6(2IN-)
NetR80_1: R80.1 R81.2 U7.5(2IN+)
NetR83_1: R83.1 R89.2 U7.1(1OUT)
NetR83_2: R83.2 R87.1 U7.2(1IN-)
NetR90_1: R90.1 R91.2 U7.3(1IN+)
NetR97_2: R97.2 U9.4(IN0)
NetR98_2: R98.2 U9.5(IN1)
NetR101_2: R101.2 U9.10(IN6)
NetR104_2: R104.2 U9.11(IN7)

### Channels
MOSFET_BANK: designators end in _MOSFET_BANK#1; ports ADC_MISO=ADC1_MISO ADC_MOSI=ADC1_MOSI ADC_nCS=ADC1_nCS ADC_SCLK=ADC1_SCLK M1_OUT=M1_OUT M1_TRIG=M1_TRIG M2_OUT=M2_OUT M2_TRIG=M2_TRIG M3_OUT=M3_OUT M3_TRIG=M3_TRIG M4_OUT=M4_OUT M4_TRIG=M4_TRIG STAT_12=M12_STAT STAT_34=M34_STAT
MOSFET_BANK: designators end in _MOSFET_BANK#2; ports ADC_MISO=ADC2_MISO ADC_MOSI=ADC2_MOSI ADC_nCS=ADC2_nCS ADC_SCLK=ADC2_SCLK M1_OUT=M1_OUT M1_TRIG=M5_TRIG M2_OUT=M2_OUT M2_TRIG=M6_TRIG M3_OUT=M3_OUT M3_TRIG=M7_TRIG M4_OUT=M4_OUT M4_TRIG=M8_TRIG STAT_12=M56_STAT STAT_34=M78_STAT
MOSFET_BANK: designators end in _MOSFET_BANK#3; ports ADC_MISO=ADC3_MISO ADC_MOSI=ADC3_MOSI ADC_nCS=ADC3_nCS ADC_SCLK=ADC3_SCLK M1_OUT=M1_OUT M1_TRIG=M9_TRIG M2_OUT=M2_OUT M2_TRIG=M10_TRIG M3_OUT=M3_OUT M3_TRIG=M11_TRIG M4_OUT=M4_OUT M4_TRIG=M12_TRIG STAT_12=M910_STAT STAT_34=M1112_STAT

### Notes on the sheet
- INPUTS
- OUTPUTS
- I AND V SENSE
- I SENSE AMPS
- V SENSE DIVIDER MAY BE MIS_SIZED TEST!!!!!!!
- (near U8) Is footprint ok? P# is off
- SMART MOSFET IC
- ADC SPI
- (near U8) Maybe add cap?
- STANDALONE ADC IC
- Status LEDs
- (near R104) Current limiting resistors
- UNLABELLED RESISTORS ARE 10K

### Library data of the parts
C20 C21 = CMP-2008-02046-2: as C8 on sheet STM32H753_PINOUT; Package: C0402-BB; Temperature: -55°C to +125°C; ComponentLink2Description: Datasheet; Temperature Characteristic: X5R; Device Class L1: Passive Components; Height: 0.55mm; Lead Free: Yes; ComponentLink2URL: https://content.kemet.com/datasheets/KEM_C1002_X7R_SMD.pdf; Device Class L2: Capacitors; Temperature Range Low: -55°C; Temperature Range High: +125°C; RoHS: TRUE; Octopart: https://octopart.com/c0402c104k8pactu-kemet-140039; Automotive: No; Mouser Description: Capacitor 100 nF 10 VDC 0402; Category: Cap; Voltage Rating: 10 V; Digikey Description: CAP CER 0.1UF 10V X5R 0402; Ipc Land Pattern Name: CAPC10050X50; Device Class L3: Ceramic Capacitors; Manufacturer Part Number: C0402C104K8PACTU
D10-D13 = CMP-004-00034-2: as D7 on sheet STM32H753_PINOUT
R47 R48 R57 R58 R97 R98 R101 R104 = CMP-2000-00180-1: Manufacturer: Panasonic; Part Number: ERJ-3EKF1001V
R49 R59 R64 R71 R74 R81 R83 R91 = CMP-1012-00849-3: RES SMD 1M OHM 1% 1/10W 0603; Resistance: 1MR; Voltage Rating: 75V; Temperature Coefficient: 100ppm/°C; Power Rating: 100mW; REACH SVHC: No SVHC; Radiation Hardening: No; Features: Automotive AEC-Q200; Case Code (Metric): 1608; Resistance Tolerance: 1%; Case/Package: 0603; Termination: SMD/SMT; Max Operating Temperature: 155°C; Tolerance: 1%; Size Code: 0603; Case Code (Imperial): 0603; Min Operating Temperature: -55°C; Number of Pins: 2; Mount: Surface Mount; Package Quantity: 1; Military Standard: Not; Voltage Rating (DC): 75V; Depth: 0.8mm; Packaging: Tape and Reel; Width: 0.8mm; Number of Terminations: 2; Length: 1.6mm; Height: 0.022inch; RoHS Compliant: Yes; Resistor Type: Thick Film; Contact Plating: Tin; Lead Free: Lead Free; Series: ERJ; Construction: Rectangular; Max Power Dissipation: 100mW
R52 R66 R76 R86 = CMP-33361-000012-1: RES SMD 10 MOHM 1% 2W 3264; Temperature Coefficient: 50ppm/°C; Resistance: 10mR; Voltage Rating: 220mV; Case/Package: 2512; Military Standard: Not; Max Operating Temperature: 150°C; Height: 0.024inch; Package Quantity: 1; Case Code (Imperial): 2512; Number of Terminations: 2; Features: Flame Retardant Coating; Width: 0.126inch; Tolerance: 1%; Composition: Metal Element; Number of Pins: 2; Packaging: Tape and Reel; Depth: 3.2mm; Termination: SMD/SMT; Min Operating Temperature: -55°C; Power Rating: 2W; Case Code (Metric): 6432; Max Power Dissipation: 2W; Mount: Surface Mount; Length: 6.4mm
R53 R55 R56 R63 R67 R69 R70 R73 R77 R79 R80 R84 R85 R87 R89 R90 = CMP-1012-00623-3: as R36 on sheet STM32H753_PINOUT; Number of Pins: 2; Package Reference: 603; Depth: 0.8mm; Mount: SurfaceMount; Package Description: 2-Pin Surface Mount Device, Body 1.6 x 0.85 mm; Datasheet Version: 02/2017; Length: 1.6mm; Lead Free: LeadFree; Height: 0.45mm; Number of Terminations: 2; Max Power Dissipation: 100mW; Min Operating Temperature: -55degC; Datasheet URL: https://industrial.panasonic.com/cdbs/www-data/pdf/RDA0000/AOA0000C304.pdf; Termination: SMD/SMT; Case Code (Metric): 1608; Case Code (Imperial): 0603; Tolerance: 1%; Max Operating Temperature: 155degC; RoHSCompliant: true; Voltage Rating (DC): 75V; Radiation Hardening: No; Packaging: TapeandReel; Composition: ThickFilm; Mounting Technology: SurfaceMount; Manufacturer URL: http://www.panasonic.com/; Width: 0.031inch; REACH SVHC: NoSVHC; Contact Plating: Tin; Military Standard: Not; Package Quantity: 1
R54 R68 R78 R88 R95 R96 R102 R103 = CMP-2000-00539-1: Manufacturer: Panasonic; Part Number: ERJ3EKF5100V
R60 R72 R82 R92 = CMP-2000-00389-1: Manufacturer: Panasonic; Part Number: ERJ3EKF2701V
R65 R75 = CMP-2000-00540-8: RES SMD 5.1K OHM 1% 1/10W 0603; Power Rating: 100mW; Temperature Coefficient: 100ppm/°C; Voltage Rating: 75V; Resistance: 5.1kR; Military Standard: Not; Case/Package: 0603; Packaging: Tape and Reel; Package Quantity: 1; Reach SVHC Compliant: Yes; Lead Free: Lead Free; Mount: Surface Mount; Size Code: 0603; Depth: 0.8mm; Resistance Tolerance: 1%; Number of Terminations: 2; Resistor Type: Thick Film; Width: 0.8mm; Construction: Rectangular; Series: ERJ; Radiation Hardening: No; Max Operating Temperature: 155°C; Features: Automotive AEC-Q200; Tolerance: 1%; Voltage Rating (DC): 75V; Length: 1.6mm; RoHS Compliant: Yes; Min Operating Temperature: -55°C; Case Code (Metric): 1608; Termination: SMD/SMT; Weight: 7.1E-05oz; Max Power Dissipation: 100mW; Contact Plating: Tin; Height: 0.022inch; Case Code (Imperial): 0603
R93 R94 R99 R100 = CMP-2000-00179-1: Manufacturer: Panasonic; Part Number: ERJ-3EKF1000V
U7 = CMP-2000-06547-1: Quadruple Operational Amplifier, 0.5 V/us, 1.2 MHz, 3 to 32 V, 0 to 70 degC, 14-Pin SOIC (D), Green (RoHS & no Sb/Br), Tube; Manufacturer: Texas Instruments; Unity Gain Bandwidth Product: 1.2MHz; Input Offset Voltage: 7mV; Dual Supply Voltage (Max): ±16V; Single Supply Voltage (Min): 3V; Single Supply Voltage (Max): 32V; Voltage Gain in dB: 100dB; Power Supply Requirement: Single/Dual; Input Bias Current: 250nA; Dual Supply Voltage (Min): ±1.5V; Single Supply Voltage (Typ): 5/9/12/15/18/24/28V; Dual Supply Voltage (Typ): ±3/±5/±9/±12/±15V; Number of  Elements: 4; Common Mode Rejection Ratio: 65dB; Datasheet Version: Rev. W, 03/2015; Technology: Bipolar; Shut Down Feature: No; Package Reference: D0014A; Type: GeneralPurposeAmplifier; Pin Count: 14; Package Type: SOIC; Rail/Rail I/O Type: No; Manufacturer URL: http://www.ti.com/; Package Description: 14-Pin Small Outline Integrated Circuit, Body 8.65 x 3.9 mm, Pitch 1.27 mm; Operating Temperature Classification: Commercial; Datasheet URL: http://www.ti.com/lit/ds/symlink/lm324.pdf; Slew Rate: 0.5V/us; Package URL: http://www.ti.com/lit/ml/mpds177g/mpds177g.pdf; Mounting: SurfaceMount; Packaging: Rail/Tube; Mounting Technology: SurfaceMount; Operating Temp Range: 0Cto70C
U8 = CMP-1095-00041-1: Smart High-Side Power Switch for Industrial Applications 4 Channels: 4 x 140 mOhm Status Feedback, 5.5 to 40 V Operating, -30 to 85 degC, PG-DSO-20-32, Reel, Green; Manufacturer: Infineon; Green: TRUE; Operating Voltage Range (max): 40 V; Operating Voltage Range (min): 5.5Â V; Ptot (max): 3.6Â W; Diagnostic: Digital; IL (nom)min - one channel active: 2.3Â A; RON (max) @ Tj max: 280 mOhm; RON @ 25 degC: 140 mOhm (max); IL (SC): 9 A; IL (nom)min - all channels active: 1.3Â A; toff (max): 270 us; Channels: 4; ton (max): 250 us; ComponentLink1Description: Manufacturer URL; Packing: Reel; ComponentLink3Description: Package Specification; ComponentLink1URL: http://www.infineon.com/; Halogen-free: available; Mounting Technology: Surface Mount; PartNumber: ITS716G; ComponentLink3URL: http://www.infineon.com/dgdl/BTS+4130QGA_DS10+_neu.pdf?folderId=db3a304314dca389011537739e37155f&fileId=db3a30431a5c32f2011a957932285680&sId=db3a30433d68e984013d7f42d6576278; PackageVersion: Mar-08; ComponentLink2Description: Datasheet; ComponentLink2URL: http://www.infineon.com/dgdl/ITS716G_DS11_20081002.pdf?folderId=db3a304412b407950112b408e8c90004&fileId=db3a304412b407950112b428c2cf3e6d; DatasheetVersion: Rev. 1.1; PackageDescription: 20-Pin Plastic (Green) Dual Small Outline Package, 12.7 x 7.5 mm Body, 1.27 mm Pitch; Load Current (typ): 1.3Â A; PackageReference: PG-DSO-20-32; IL (SCp): 9 A
U9 = CMP-0054-00372-2: 8-Channel, 50 kSPS to 200 kSPS, 8-Bit A/D Converter, 16-pin TSSOP, Pb-Free; Manufacturer: National Semiconductor; PackageTopMarking: NSUZXYTT*88S022*CIMT; CompType: ADC IC; PowerWise: Y; ComponentLink2URL: http://www.national.com/pf/AD/ADC088S022.html; RoHS: Y; PackageDescription: Molded TSSOP, Jedec, 5 x 4.4 x 0.9mm Body, 16 Lead, 0.65mm Pitch; DatasheetVersion: Feb-2010; PinCount: 16; ComponentLink1Description: ADC088S022 Datasheet; Code_JEDEC: MO-153-AB; ComponentLink3URL: http://www.national.com/packaging/folders/mtc16.html; PackageVersion: revD, Jun-2003; ComponentLink3Description: MTC16 Package Page; RevisionNote: Component URLs added; ComponentLink1URL: http://www.national.com/ds/AD/ADC088S022.pdf; ComponentLink2Description: ADC088S022 Web Page; PackageReference: MTC16

## Nets that join several sheets
3V3: INTERNAL_REGULATORS (C?#2.1 R?#1.2 U?#1.4), STM32H753_PINOUT (26 pins), MOSFET_BANK (C20_MOSFET_BANK#1.1 C21_MOSFET_BANK#1.1 U9_MOSFET_BANK#1.2 U9_MOSFET_BANK#1.13), MOSFET_BANK (C20_MOSFET_BANK#2.1 C21_MOSFET_BANK#2.1 U9_MOSFET_BANK#2.2 U9_MOSFET_BANK#2.13), MOSFET_BANK (C20_MOSFET_BANK#3.1 C21_MOSFET_BANK#3.1 U9_MOSFET_BANK#3.2 U9_MOSFET_BANK#3.13)
+12: LightLink_V4 (6 pins), PWR_MGMT (Q10.5-6-7-8 Q13.5-6-7-8 R9.1)
GND: LightLink_V4 (24 pins), PWR_MGMT (25 pins), INTERNAL_REGULATORS (C?#1.2 C?#2.2 R?#2.1 U?#1.1), STM32H753_PINOUT (36 pins), MOSFET_BANK (25 pins), MOSFET_BANK (25 pins), MOSFET_BANK (25 pins)
VCC: PWR_MGMT (5 pins), INTERNAL_REGULATORS (C?#1.1 U?#1.3), STM32H753_PINOUT (LS2.P), MOSFET_BANK (11 pins), MOSFET_BANK (11 pins), MOSFET_BANK (11 pins)
12V_IN: LightLink_V4 (J6.1 J6.3), PWR_MGMT (F2.1)
CAN1_N: PWR_MGMT (R26.1), STM32H753_PINOUT (R43.1 U6.6)
CAN1_P: PWR_MGMT (R18.1), STM32H753_PINOUT (R43.2 U6.7)
M1_OUT: LightLink_V4 (J1.8), MOSFET_BANK (R52_MOSFET_BANK#1.2 R53_MOSFET_BANK#1.2 R54_MOSFET_BANK#1.2)
M1_OUT: LightLink_V4 (J2.8), MOSFET_BANK (R52_MOSFET_BANK#2.2 R53_MOSFET_BANK#2.2 R54_MOSFET_BANK#2.2)
M1_OUT: LightLink_V4 (J3.8), MOSFET_BANK (R52_MOSFET_BANK#3.2 R53_MOSFET_BANK#3.2 R54_MOSFET_BANK#3.2)
M2_OUT: LightLink_V4 (J1.7), MOSFET_BANK (R66_MOSFET_BANK#1.2 R67_MOSFET_BANK#1.2 R68_MOSFET_BANK#1.2)
M2_OUT: LightLink_V4 (J2.7), MOSFET_BANK (R66_MOSFET_BANK#2.2 R67_MOSFET_BANK#2.2 R68_MOSFET_BANK#2.2)
M2_OUT: LightLink_V4 (J3.7), MOSFET_BANK (R66_MOSFET_BANK#3.2 R67_MOSFET_BANK#3.2 R68_MOSFET_BANK#3.2)
M3_OUT: LightLink_V4 (J1.6), MOSFET_BANK (R76_MOSFET_BANK#1.2 R77_MOSFET_BANK#1.2 R78_MOSFET_BANK#1.2)
M3_OUT: LightLink_V4 (J2.6), MOSFET_BANK (R76_MOSFET_BANK#2.2 R77_MOSFET_BANK#2.2 R78_MOSFET_BANK#2.2)
M3_OUT: LightLink_V4 (J3.6), MOSFET_BANK (R76_MOSFET_BANK#3.2 R77_MOSFET_BANK#3.2 R78_MOSFET_BANK#3.2)
M4_OUT: LightLink_V4 (J1.5), MOSFET_BANK (R86_MOSFET_BANK#1.2 R87_MOSFET_BANK#1.2 R88_MOSFET_BANK#1.2)
M4_OUT: LightLink_V4 (J2.5), MOSFET_BANK (R86_MOSFET_BANK#2.2 R87_MOSFET_BANK#2.2 R88_MOSFET_BANK#2.2)
M4_OUT: LightLink_V4 (J3.5), MOSFET_BANK (R86_MOSFET_BANK#3.2 R87_MOSFET_BANK#3.2 R88_MOSFET_BANK#3.2)
PWR_IN: LightLink_V4 (J4.1 J4.2 J4.5 J4.6), PWR_MGMT (F1.1)